# Altium schematic sheet Power_A.SchDoc
size A4
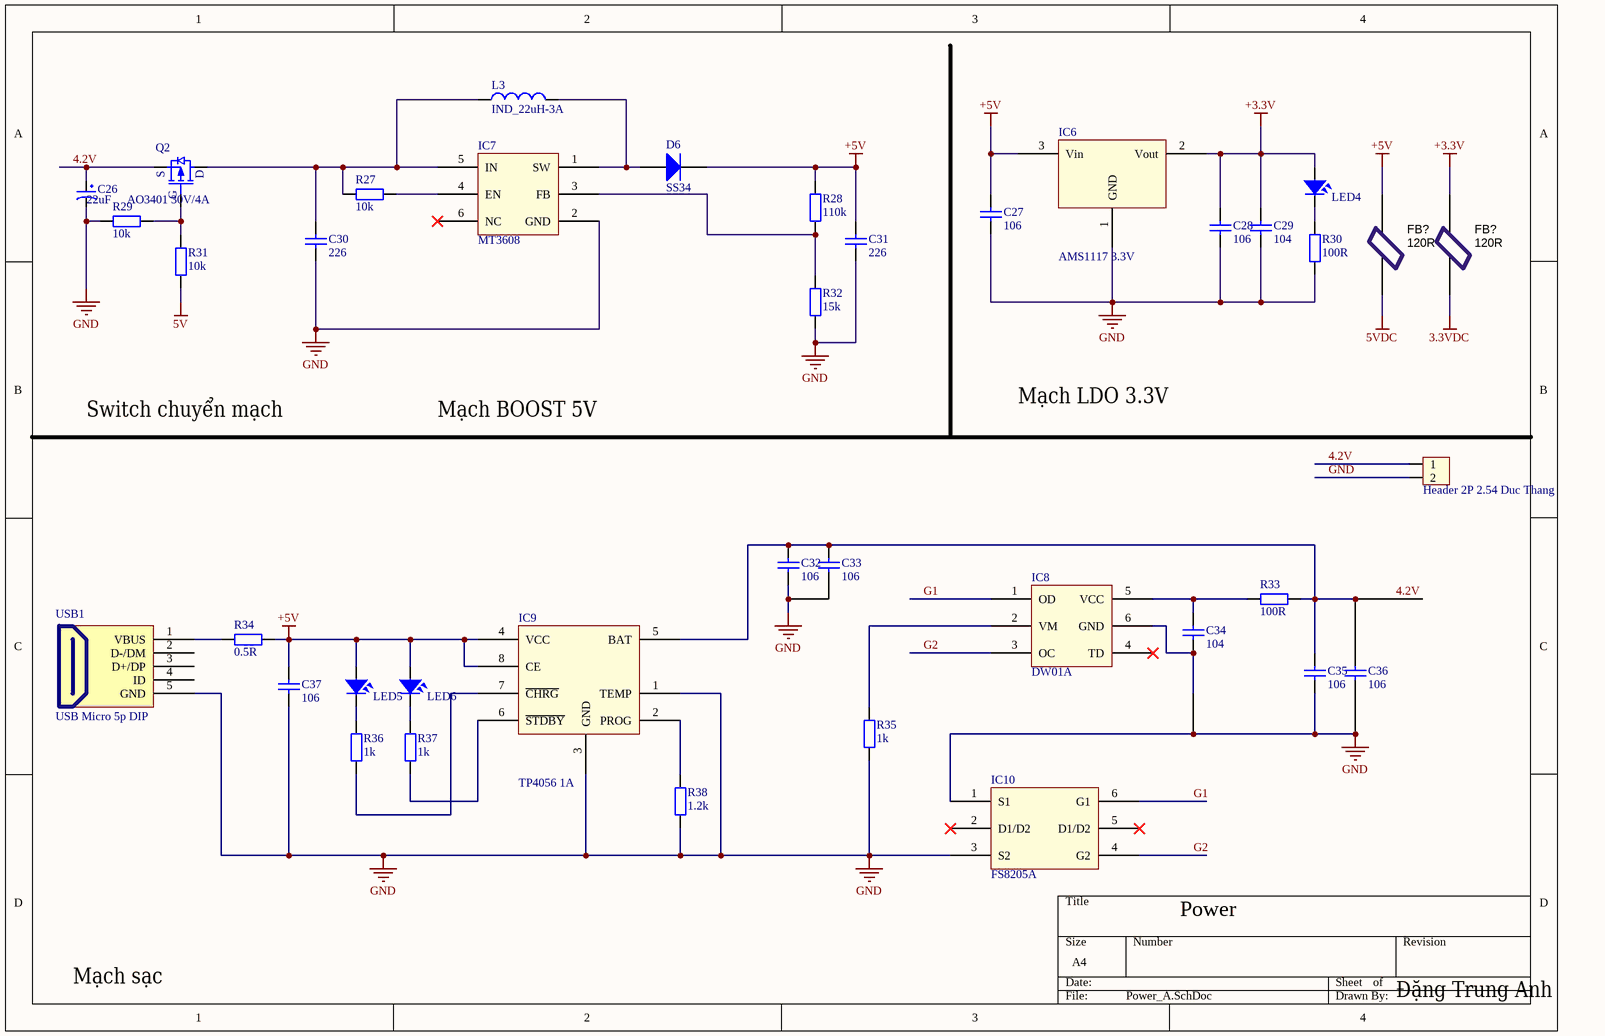
[diagram p0: Power_A.SchDoc]

## Parts
(Parts that share a designator on the sheet are numbered #1, #2 ... from top to bottom, then left to right.)
C26  22uF  [tu hoa 5mm]
C27  106  [Tu 0805]
C28  106  [Tu 0805]
C29  104  [tu 0805]
C30  226  [tu 0805]
C31  226  [tu 0805]
C32  106  [tu 0805]
C33  106  [Tu 0805]
C34  104  [tu 0805]
C35  106  [Tu 0805]
C36  106  [Tu 0805]
C37  106  [Tu 0805]
D6  SS34  [DO_SMD_NEW]
FB?#1  120R  [INDC1608N]
FB?#2  120R  [INDC1608N]
H2  Header 2P 2.54 Duc Thang  [XH2.54M-2]
IC6  AMS1117 3.3V  [SOT223]
IC7  MT3608  [SOT23-6A]
IC8  DW01A  [SOT23127P600-8N]
IC9  TP4056 1A  [SOP8]
IC10  FS8205A  [SOT-23-6L]
L3  IND_22uH-3A  [IND_22_12X12_SMD]
LED4  LED SMD  [SM-LED-0805-Red]  (value not drawn)
LED5  LED SMD  [SM-LED-0805-Red]  (value not drawn)
LED6  LED SMD  [SM-LED-0805-Blue]  (value not drawn)
Q2  AO3401 30V/4A  [SOT23_3]
R27  10k  [tro smd 0805]
R28  110k  [tro smd 0805]
R29  10k  [tro smd 0805]
R30  100R  [tro smd 0805]
R31  10k  [tro smd 0805]
R32  15k  [tro smd 0805]
R33  100R  [tro smd 0805]
R34  0.5R  [tro smd 0805]
R35  1k  [tro smd 0805]
R36  1k  [tro smd 0805]
R37  1k  [tro smd 0805]
R38  1.2k  [tro smd 0805]
USB1  USB Micro 5p DIP  [USB Micro 5p DIP]

## Nets
3.3VDC: FB?#2.?2
5V: R31.1
5VDC: FB?#1.?2
+3.3V: C28.1 C29.1 FB?#2.?1 IC6.2(Vout) LED4.1
+5V: C27.1 C31.1 C37.1 D6.2(K) FB?#1.?1 IC6.3(Vin) IC9.4(VCC) IC9.8(CE) LED5.1 LED6.1 R28.2 R34.2
GND: C26.2 C27.2 C28.2 C29.2 C30.2 C31.2 C32.1 C33.2 C34.1 C35.2 C36.2 C37.2 H2.2 IC6.1(GND) IC7.2(GND) IC8.6(GND) IC9.1(TEMP) IC9.3(GND) IC10.1(S1) IC10.3(S2) R29.1 R30.1 R32.1 R35.1 R38.1 USB1.5(GND)
4.2V: C26.1 C32.2 C33.1 C35.1 C36.1 H2.1 IC9.5(BAT) Q2.2(S) R33.2
G1: IC8.1(OD) IC10.6(G1)
G2: IC8.3(OC) IC10.4(G2)
NetC30_1: C30.1 IC7.5(IN) L3.1 Q2.3(D) R27.2
NetC34_2: C34.2 IC8.5(VCC) R33.1
NetD6_1: D6.1(A) IC7.1(SW) L3.2
NetIC7_3: IC7.3(FB) R28.1 R32.2
NetIC7_4: IC7.4(EN) R27.1
NetIC8_2: IC8.2(VM) R35.2
NetIC9_2: IC9.2(PROG) R38.2
NetIC9_6: IC9.6(~{STDBY}) R37.1
NetIC9_7: IC9.7(~{CHRG}) R36.1
NetLED4_2: LED4.2 R30.2
NetLED5_2: LED5.2 R36.2
NetLED6_2: LED6.2 R37.2
NetQ2_1: Q2.1(G) R29.2 R31.2
NetR34_1: R34.1 USB1.1(VBUS)

Not connected (* = marked no-connect by the designer): IC7 6(NC)*; IC8 4(TD)*; IC10 2(D1/D2)* 5(D1/D2)*; USB1 2(D-/DM) 3(D+/DP) 4(ID)

## Notes on the sheet
- Switch chuyển mạch
- Mạch BOOST 5V
- Mạch LDO 3.3V
- Power
- Mạch sạc
- Đặng Trung Anh

## Library data of the parts
C26 = Tu Hoa 22uF 35V 5x11: Cắm; Don_Vi: Con; So_Chan: 2; Ten_Linh_Kien: Tụ Hóa 22uF 35V 5x11MM; Ma_Hang: MH001350; Chung_Loai: Cắm; Kieu_Chan: *
C27 C28 C32 C33 C35-C37 = Tu 0805 106 16V 10%: Dán; Ten_Linh_Kien: Tụ 0805 106-10uF 10% 16V; So_Chan: 2; Don_Vi: Con; Ma_Hang: MH004553; Chung_Loai: Dán; Kieu_Chan: *
C29 C34 = Tu 0805 104 50V 10%: Dán; Don_Vi: Con; So_Chan: 2; Ten_Linh_Kien: Tụ 0805 104-100nF 10% 50V; Ma_Hang: MH004551; Chung_Loai: Dán; Kieu_Chan: *
C30 = Tu 0805 224 50V 10%: Dán; Don_Vi: Con; So_Chan: 2; Ten_Linh_Kien: Tụ 0805 224-0.22uF 10% 50V; Ma_Hang: MH004559; Chung_Loai: Dán; Kieu_Chan: *
C31 = Tu 0805 226 16V 20%: Dán; Don_Vi: Con; So_Chan: 2; Ten_Linh_Kien: Tụ 0805 224-0.22uF 10% 50V; Ma_Hang: MH004559; Chung_Loai: Dán; Kieu_Chan: *
D6 = Diode SS34 ( 1N5822 ): Dán; Don_Vi: Con; Ma_Hang: MH002104; Ten_Linh_Kien: Diode SS34 3A 40V SMA ( 1N5822 SS34A); Kieu_Chan: *; Chung_Loai: Dán
FB?#1 FB?#2 = FERRITE_120R_2.5A-0603: Ferrite bead 120 Ohm at 100 MHz 2A 0603 SMD; Manufacturer 1: Murata Electronics North America; Current: 900mA; DC Resistance (DCR): 172.9 mOhm Max; Frequency - Self Resonant: 23MHz; Frequency - Test: 100kHz; Impedance @ Frequency: 120 Ohm @ 100MHz; Filter Type: Differential Mode - Single; Number of Lines: 1; Ratings: 2 A; 50 mO DC; Value: 120R @ 100 MHz; SCDType: source; Current - Saturation: 900mA; Current - Temperature Rise: 900mA; Applications: Power Supplies; Package / Case: 1210 (3225 Metric); Operating Temperature: -40°C ~ 105°C; ComponentLink1URL: http://www.yuden.co.jp/ut/product/pdf/wound02_e.pdf; ComponentLink1Description: http://www.yuden.co.jp/ut/product/pdf/wound02_e.pdf; Supplier 1: Digi-Key; Supplier Part Number 1: 490-1037-1-ND; Current Rating: 2A; Mounting Type: Surface Mount; Height (Max): 0.037" (0.95mm); Size / Dimension: 0.063" L x 0.031" W (1.60mm x 0.80mm); ComponentLink2URL: http://search.murata.co.jp/Ceramy/image/img/PDF/ENG/L0110S0100BLM18P.pdf; ComponentLink2Description: http://search.murata.co.jp/Ceramy/image/img/PDF/ENG/L0110S0100BLM18P.pdf
H2 = Header 2P 2.54 Duc Thang: Cắm; Ten_Linh_Kien: Header 2P XH2.54-2P Đực Thẳng; Don_Vi: Con; Ma_Hang: MH001283; Chung_Loai: Cắm
IC7 = MT3608_Boost
L3 = IND_22uH-3A-30%-SMD_1: Fixed Inductors MSS1038 SMT Shielded 15 uH 20 % 3.8 A; Manufacturer: Bourns; Manufacturer Part Number: MSS1038-153MLC; Alternate Part Number-1: NA; Case/Package: SMD; Supplier-1: COILCRAFT SAMPLE; Supplier Part Number-1: MSS1038-153MLC
LED4-LED6 = LED-SMD-0805
Q2 = AO3401: MOSFET P-CH 30V 4A SOT23; MPN: AO3415; MFR: Alpha & Omega Semiconductor Inc.; Value: 20V/4A; Solder: SMT
R27 R29 R31 = Tro 0805 5% 10k: Dán; Don_Vi: Con; So_Chan: 2; Ten_Linh_Kien: Trở 0805 5% 10k; Ma_Hang: MH005239; Chung_Loai: Dán; Kieu_Chan: *
R28 = Tro 0805 1% 110k: Dán; Don_Vi: Con; So_Chan: 2; Ten_Linh_Kien: Trở 0805 1% 10k; Ma_Hang: MH005473; Chung_Loai: Dán; Kieu_Chan: *
R30 R33 = Tro 0805 5% 100R: Dán; Don_Vi: Con; So_Chan: 2; Ten_Linh_Kien: Trở 0805 5% 100R; Ma_Hang: MH005251; Chung_Loai: Dán; Kieu_Chan: *
R32 = Tro 0805 1% 15k: Dán; Don_Vi: Con; So_Chan: 2; Ten_Linh_Kien: Trở 0805 1% 15k; Ma_Hang: MH005476; Chung_Loai: Dán; Kieu_Chan: *
R34 = Tro 0805 5% 0.5R: Dán; Don_Vi: Con; So_Chan: 2; Ten_Linh_Kien: Trở 0805 5% 0.5R; Ma_Hang: MH005303; Chung_Loai: Dán; Kieu_Chan: *
R35-R37 = Tro 0805 5% 1k: Dán; Don_Vi: Con; So_Chan: 2; Ten_Linh_Kien: Trở 0805 5% 1k; Ma_Hang: MH005234; Chung_Loai: Dán; Kieu_Chan: *
R38 = Tro 0805 5% 1.2k: Dán; Don_Vi: Con; So_Chan: 2; Ten_Linh_Kien: Trở 0805 5% 1.2k; Ma_Hang: MH005231; Chung_Loai: Dán; Kieu_Chan: *
USB1 = USB Micro 5p DIP: USB Type B; Ten: MicroUSB MK5P DIP; Ma_Hang: MH005145